# EAGLE design mother (EAGLE 9.6.2)
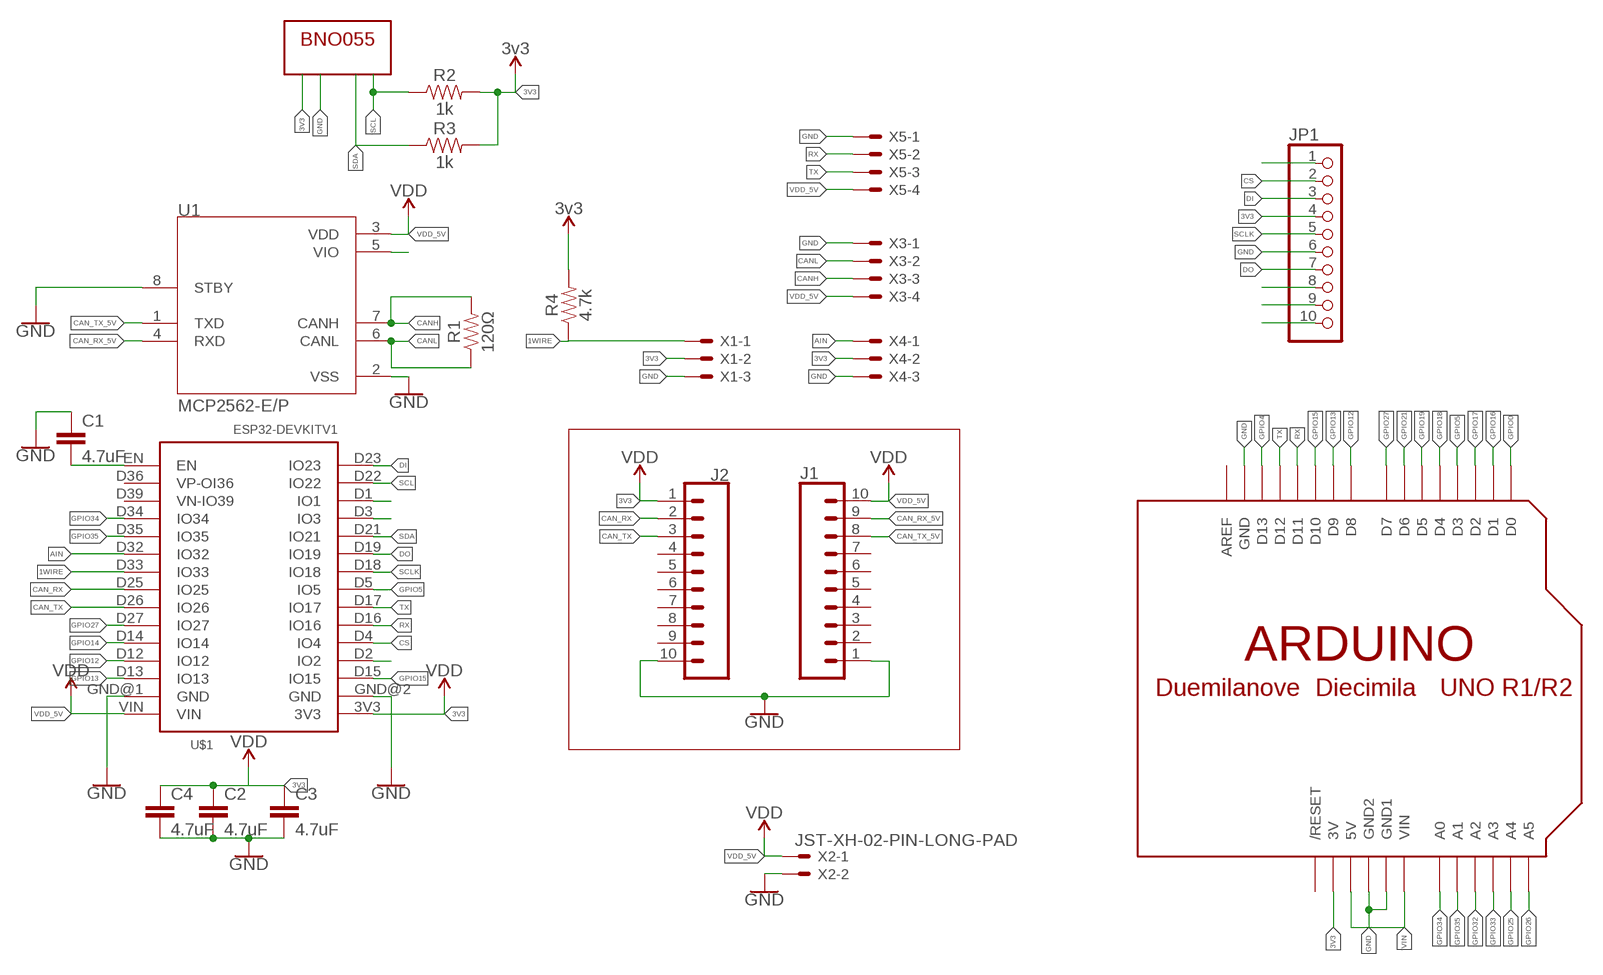
[diagram p0: schematic, sheet 1]

## Parts
C1  4.7uF  4.7UF-0603-6.3V-(10%)  [0603]
C2  4.7uF  4.7UF-0603-6.3V-(10%)  [0603]
C3  4.7uF  4.7UF-0603-6.3V-(10%)  [0603]
C4  4.7uF  4.7UF-0603-6.3V-(10%)  [0603]
J1  CONN_10"  [1X10]
J2  CONN_10"  [1X10]
JP1  PINHD-1X10  [1X10]
R1  120Ω  RESISTORAXIAL-0.3  [AXIAL-0.3]
R2  1k  1KOHM-0603-1/10W-1%  [0603]
R3  1k  1KOHM-0603-1/10W-1%  [0603]
R4  4.7k  4.7KOHM-0603-1/10W-1%  [0603]
U1  MCP2562-E/P  [DIP787W45P254L1016H533Q8]
U$1  ESP32DEVKITV1  [ESP32-DEVKITV1]
U$2  ARDUINO-NOHOLE  [ARDUINO-NOHOLE]
U$3  AE-BNO055-BO  [AE-BNO055-BO]
X1  JST-XH-03-PIN-LONG-PAD  [JST-XH-03-PACKAGE-LONG-PAD]
X2  JST-XH-02-PIN-LONG-PAD  [JST-XH-02-PACKAGE-LONG-PAD]
X3  JST-XH-04-PIN-LONG-PAD  [JST-XH-04-PACKAGE-LONG-PAD]
X4  JST-XH-03-PIN-LONG-PAD  [JST-XH-03-PACKAGE-LONG-PAD]
X5  JST-XH-04-PIN-LONG-PAD  [JST-XH-04-PACKAGE-LONG-PAD]

## Nets
1WIRE [lev3]: R4.1 U$1.D33(IO33) X1.1
3V3: C2.1 C3.1 C4.1 J2.1 JP1.4 R2.2 R3.2 R4.2 U$1.3V3 U$2.3V U$3.VIN X1.2 X4.2 ; supply symbol labelled VDD, 3v3
AIN: U$1.D32(IO32) X4.1
CAN_RX [lev3]: J2.2 U$1.D25(IO25)
CAN_RX_5V: J1.9 U1.4(RXD)
CAN_TX [lev3]: J2.3 U$1.D26(IO26)
CAN_TX_5V: J1.8 U1.1(TXD)
CANH [lev3]: R1.P$2 U1.7(CANH) X3.3
CANL [lev3]: R1.P$1 U1.6(CANL) X3.2
CS: JP1.2 U$1.D4(IO4)
DI: JP1.3 U$1.D23(IO23)
DO: JP1.7 U$1.D19(IO19)
EN: C1.2 U$1.EN
GND: C1.1 C2.2 C3.2 C4.2 J1.1 J2.10 JP1.6 U1.2(VSS) U1.8(STBY) U$1.GND@1(GND) U$1.GND@2(GND) U$2.GND U$2.GND1 U$2.GND2 U$3.GND X1.3 X2.2 X3.1 X4.3 X5.1
GPIO0: U$2.D0
GPIO1: U$1.D1(IO1)
GPIO4: U$2.D13
GPIO5: U$1.D5(IO5) U$2.D3
GPIO12: U$1.D12(IO12) U$2.D8
GPIO13: U$1.D13(IO13) U$2.D9
GPIO14: U$1.D14(IO14)
GPIO15: U$1.D15(IO15) U$2.D10
GPIO16: U$2.D1
GPIO17: U$2.D2
GPIO18: U$2.D4
GPIO19: U$2.D5
GPIO21: U$2.D6
GPIO25: U$2.A4
GPIO26: U$2.A5
GPIO27: U$1.D27(IO27) U$2.D7
GPIO32: U$2.A2
GPIO33: U$2.A3
GPIO34: U$1.D34(IO34) U$2.A0
GPIO35: U$1.D35(IO35) U$2.A1
N$1: JP1.1
N$2: U$1.D3(IO3)
N$5: U$1.D2(IO2)
N$7: U1.5(VIO)
N$8: JP1.8
N$9: JP1.9
N$10: JP1.10
RX: U$1.D16(IO16) U$2.D11 X5.2
SCL [lev3]: R2.1 U$1.D22(IO22) U$3.SCL
SCLK: JP1.5 U$1.D18(IO18)
SDA [lev3]: R3.1 U$1.D21(IO21) U$3.SDA
TX: U$1.D17(IO17) U$2.D12 X5.3
VDD_5V: J1.10 U1.3(VDD) U$1.VIN X2.1 X3.4 X5.4 ; supply symbol labelled VDD
VIN: U$2.5V U$2.VIN
Unconnected: J1.2 J1.3 J1.4 J1.5 J1.6 J1.7 J2.4 J2.5 J2.6 J2.7 J2.8 J2.9 U$1.D36(VP-OI36) U$1.D39(VN-IO39) U$2.AREF U$2.RESET(/RESET)

## Library data of the parts
C1-C4 = SparkFun-Capacitors:4.7UF: 4.7µF ceramic capacitors A capacitor is a passive two-terminal electrical component used to store electrical energy temporarily in an electric field.; PROD_ID: CAP-08280
J1 J2 = SparkFun-Connectors:CONN_10: Multi connection point. Often used as Generic Header-pin footprint for 0.1 inch spaced/style header connections On any of the 0.1 inch spaced packages, you can populate with these: Break Away Headers - Straight <https://www.sparkfun.com/products/116> (PRT-00116) Break Away Male Headers - Right Angle <https://www.sparkfun.com/products/553> (PRT-00553) Female Headers <https://www.sparkfun.com/products/115> (PRT-00115) Break Away Headers - Machine Pin <https://www.sparkfun.com/products/117> (PRT-00117) Break Away Female Headers - Swiss Machine Pin <https://www.sparkfun.com/products/743> (PRT-00743) Arduino Stackable Header - 10 Pin <https://www.sparkfun.com/products/11376> (PRT-11376) For SCREWTERMINALS and SPRING TERMINALS visit here: Screw Terimnals on SparkFun.com <https://www.sparkfun.com/search/results?term=Screw+Terminals> (5mm/3.5mm/2.54mm spacing) This device is also useful as a general connection point to wire up your design to another part of your project. Our various solder wires solder well into these plated through hole pads. Hook-Up Wire - Assortment (Stranded, 22 AWG) <https://www.sparkfun.com/products/11375> (PRT-11375) Hook-Up Wire - Assortment (Solid Core, 22 AWG) <https://www.sparkfun.com/products/11367> (PRT-11367) View the entire wire category on our website here <https://www.sparkfun.com/categories/141> Special notes: Molex polarized connector foot print use with SKU : PRT-08231 with associated crimp pins and housings. 1MM SMD Version SKU: PRT-10208 NOTES ON THE VARIANTS LOCK and LOCK_LONGPADS... This footprint was designed to help hold the alignment of a through-hole component (i.e. 6-pin header) while soldering it into place. You may notice that each hole has been shifted either up or down by 0.005 of an inch from it's more standard position (which is a perfectly straight line). This slight alteration caused the pins (the squares in the middle) to touch the edges of the holes. Because they are alternating, it causes a "brace" to hold the component in place. 0.005 has proven to be the perfect amount of "off-center" position when using our standard breakaway headers. Although looks a little odd when you look at the bare footprint, once you have a header in there, the alteration is very hard to notice. Also,if you push a header all the way into place, it is covered up entirely on the bottom side.; PROD_ID: CONN-11563
JP1 = pinhead:PINHD-1X10: PIN HEADER
R1 = SparkFun-Resistors:RESISTOR: Generic Resistor Package
R2 R3 = SparkFun-Resistors:1KOHM: 1kΩ resistor A resistor is a passive two-terminal electrical component that implements electrical resistance as a circuit element. Resistors act to reduce current flow, and, at the same time, act to lower voltage levels within circuits. - Wikipedia; PROD_ID: RES-07856
R4 = SparkFun-Resistors:4.7KOHM: 4.7kΩ resistor A resistor is a passive two-terminal electrical component that implements electrical resistance as a circuit element. Resistors act to reduce current flow, and, at the same time, act to lower voltage levels within circuits. - Wikipedia; PROD_ID: RES-07857
U1 = MCP2562-E_P:MCP2562-E/P: Integrated circuit: transceiver CAN; Channels: 1; 1Mbps; DIP8 Check availability <https://pricing.snapeda.com/parts/MCP2562-E/P/Microchip/view-part?ref=eda>; AVAILABILITY: In Stock; DESCRIPTION: 1/1 Transceiver Half CANbus 8-PDIP; MF: Microchip; MP: MCP2562-E/P; PACKAGE: DIP-8 Microchip; PRICE: None; PURCHASE-URL: https://pricing.snapeda.com/search/part/MCP2562-E/P/?ref=eda
U$1 = ESP32-DEVKITV1:ESP32DEVKITV1
U$2 = adafruit:ARDUINO: Arduino Diecimila/Duemilanove Make a shield with ease, this package has all the named pins as well as the two mounting drill holes and an outline of the USB and DC power connector. The outline is on the DIMENSION layer, so if your board house uses it they will cut the outline to match. http://www.ladyada.net/library/pcb/eaglelibrary.html
U$3 = AE-BNO055:AE-BNO055-BO
X1 X4 = JST XH Connectors:JST-XH-03-PIN: JST XH Connector 2 Pin Wire to board connector. Pitch: 2,54 mm, (0.100") Number of pins: 3 Created by Rembrandt Electronics www.rembrandtelectronics.com
X2 = JST XH Connectors:JST-XH-02-PIN: JST XH Connector 2 Pin Wire to board connector. Pitch: 2,54 mm, (0.100") Number of pins: 2 Created by Rembrandt Electronics www.rembrandtelectronics.com
X3 X5 = JST XH Connectors:JST-XH-04-PIN: JST XH Connector 2 Pin Wire to board connector. Pitch: 2,54 mm, (0.100") Number of pins: 4 Created by Rembrandt Electronics www.rembrandtelectronics.com

## Net classes
1 lev3: clearance 0.5 mm

## Board
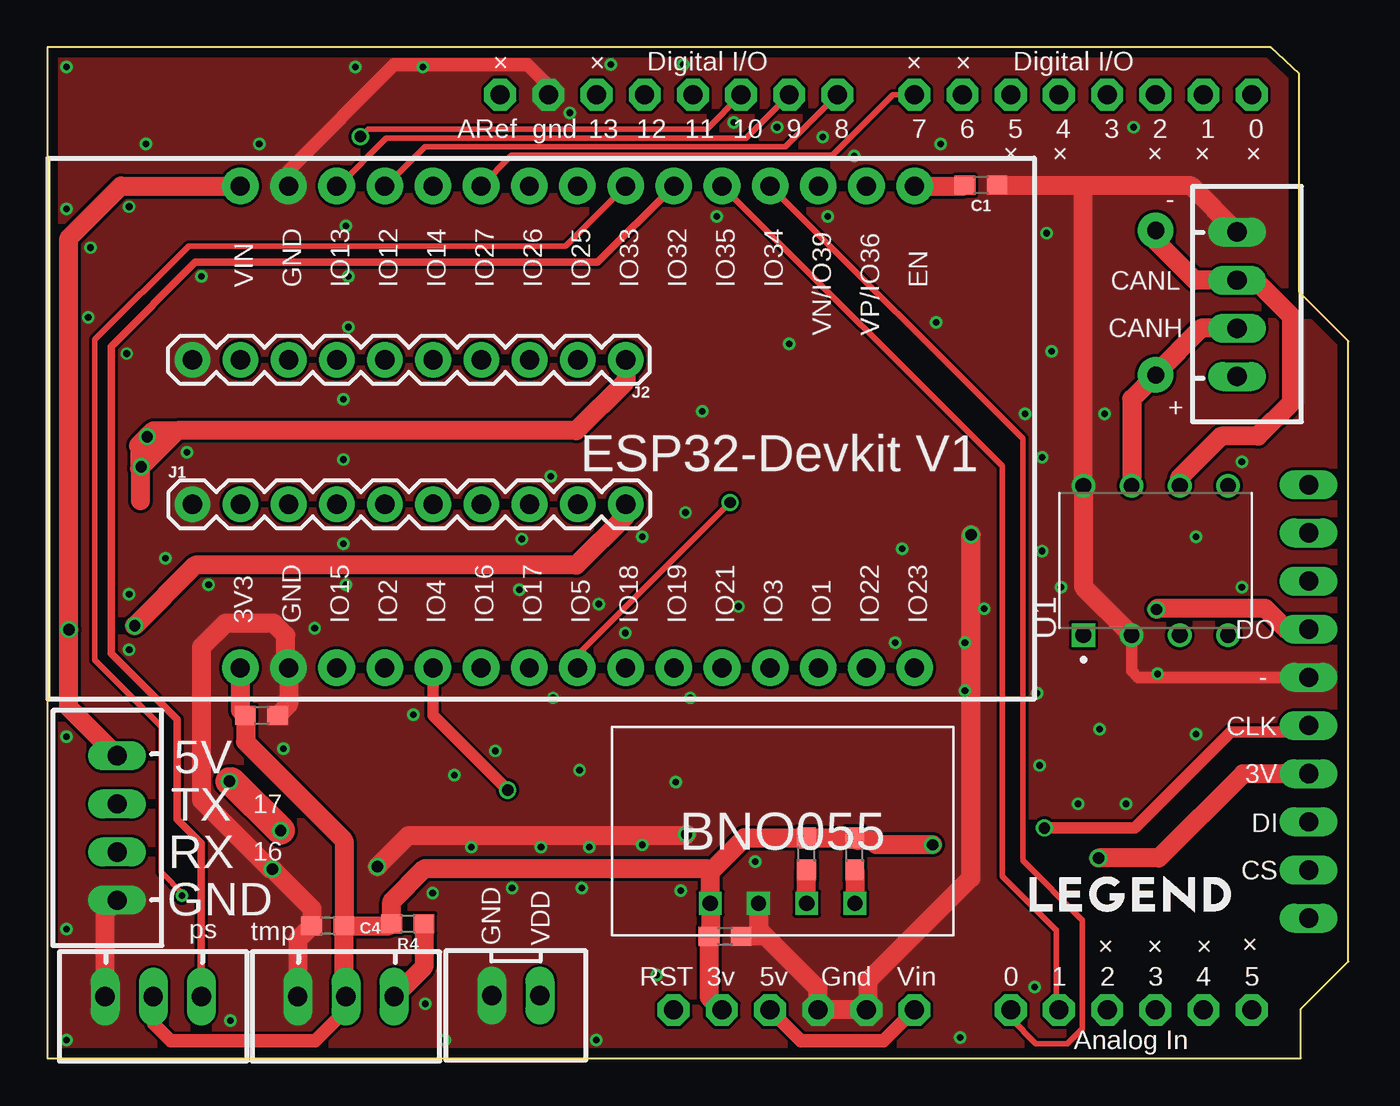
[diagram p1: board, top side]
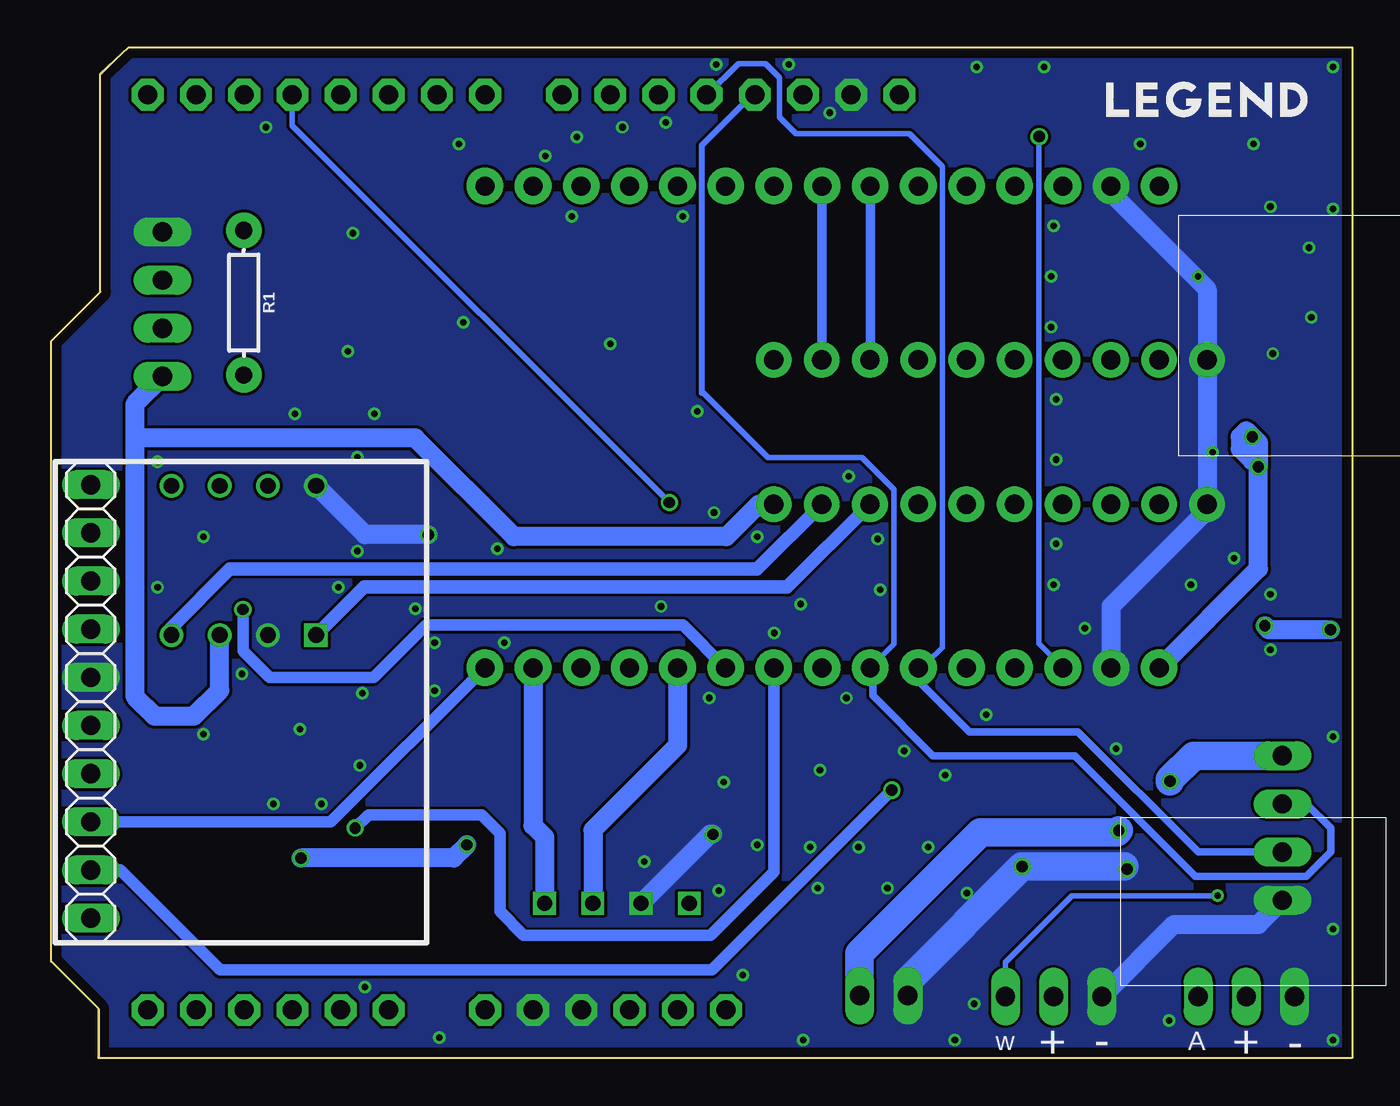
[diagram p2: board, bottom side, seen from below]

Size 68.6 x 53.3 mm. Coordinates in mm from the lower left corner, seen from the top.
Outline: 0,53.3 0,0 66.1,0 66.1,2.6 68.6,5.1 68.6,37.8 66,40.4 66,51.9 64.5,53.3 0,53.3
Copper layers (1*16): Top 0.035mm / dielectric 1.6mm / Bottom 0.035mm
Design rules "Elecrow_2-layer_PCB_eagle_rule": minimum track width 6mil, minimum drill 12mil, track to track 6mil, track to pad 6mil, pad to pad 6mil, via to via 8mil, smd to smd 0mil, copper to edge 20mil, drill to drill 10mil, minimum pad ring 6mil, minimum via ring 6mil, stop-mask expansion 0mil, vias tented up to drill 100mil, thermal gap 10mil

### Footprints (pad centres in the part's own frame; a part is rotated, then mirrored left to right if it is on the bottom)
0603 = smd 1.1 x 1: 1 -0.85,0; 2 0.85,0
1X10 = drill 1.016 pad 1.88: 1 0,0; 2 2.54,0; 3 5.08,0; 4 7.62,0; 5 10.16,0; 6 12.7,0; 7 15.24,0; 8 17.78,0; 9 20.32,0; 10 22.86,0
1X10' = drill 1.016 long: 1 -11.43,0; 2 -8.89,0; 3 -6.35,0; 4 -3.81,0; 5 -1.27,0; 6 1.27,0; 7 3.81,0; 8 6.35,0; 9 8.89,0; 10 11.43,0
AXIAL-0.3 = drill 0.9 pad 1.88: P$1 -3.81,0; P$2 3.81,0
DIP787W45P254L1016H533Q8 = drill 0.83 square: 1 -3.937,3.81 | drill 0.83: 2 -3.937,1.27; 3 -3.937,-1.27; 4 -3.937,-3.81; 5 3.937,-3.81; 6 3.937,-1.27; 7 3.937,1.27; 8 3.937,3.81
ESP32-DEVKITV1 = drill 1 pad 1.93: 3V3 -16.52,-12.27; D1 13.96,-12.27; D2 -8.9,-12.27; D3 11.42,-12.27; D4 -6.36,-12.27; D5 1.26,-12.27; D12 -8.9,13.135; D13 -11.44,13.135; D14 -6.36,13.135; D15 -11.44,-12.27; D16 -3.82,-12.27; D17 -1.28,-12.27; D18 3.8,-12.27; D19 6.34,-12.27; D21 8.88,-12.27; D22 16.5,-12.27; D23 19.04,-12.27; D25 1.26,13.135; D26 -1.28,13.135; D27 -3.82,13.135; D32 6.34,13.135; D33 3.8,13.135; D34 11.42,13.135; D35 8.88,13.135; D36 16.5,13.135; D39 13.96,13.135; EN 19.04,13.135; GND@1 -13.98,13.135; GND@2 -13.98,-12.27; VIN -16.52,13.135
ARDUINO-NOHOLE = drill 1 pad 1.676 octagon: 3V 35.56,2.54; 5V 38.1,2.54; A0 50.8,2.54; A1 53.34,2.54; A2 55.88,2.54; A3 58.42,2.54; A4 60.96,2.54; A5 63.5,2.54; AREF 23.876,50.8; D0 63.5,50.8; D1 60.96,50.8; D2 58.42,50.8; D3 55.88,50.8; D4 53.34,50.8; D5 50.8,50.8; D6 48.26,50.8; D7 45.72,50.8; D8 41.656,50.8; D9 39.116,50.8; D10 36.576,50.8; D11 34.036,50.8; D12 31.496,50.8; D13 28.956,50.8; GND 26.416,50.8; GND1 43.18,2.54; GND2 40.64,2.54; RESET 33.02,2.54; VIN 45.72,2.54
AE-BNO055-BO = drill 0.8 square: GND -1.27,-3.81; SCL 3.81,-3.81; SDA 1.27,-3.81; VIN -3.81,-3.81
JST-XH-03-PACKAGE-LONG-PAD = drill 1.016 long: 1 -2.54,0; 2 0,0; 3 2.54,0
JST-XH-02-PACKAGE-LONG-PAD = drill 1.016 long: 1 -1.27,0; 2 1.27,0
JST-XH-04-PACKAGE-LONG-PAD = drill 1.016 long: 1 -3.81,0; 2 -1.27,0; 3 1.27,0; 4 3.81,0

### Placement (x,y rotation side)
C1  49.23,46.03 180 top
C2  11.29,18.07 0 top
C3  35.74,6.43 0 top
C4  14.78,6.98 180 top
J1  7.64,29.2 0 top
J2  30.5,36.83 180 top
JP1  [1X10']  66.51,18.81 90 bottom
R1  58.44,39.84 270 bottom
R2  42.57,10.77 90 top
R3  40.03,10.77 90 top
R4  19,7.09 180 top
U1  58.44,26.25 90 top
U$1  26.69,32.86 0 top
U$2  0,0 0 top
U$3  38.77,11.97 0 top
X1  15.74,3.24 180 top
X2  24.7,3.3 180 top
X3  62.73,39.76 270 top
X4  5.58,3.24 180 top
X5  3.67,12.13 90 top

### Tracks (layer width: path | path; a pad name or v marks a point on that pad's centre or on a via)
1WIRE  (via drill 0.35)
  Top 0.3: U$1.D33 27.33,42.83 7.45,42.83 2.51,37.89 2.51,20.99 6,17.5 6,9.81 7.17,8.64 v7.09,8.57
  Top 1: R4.1 19.85,4.82 X1.1
  Bottom 0.3: X1.1 18.28,5.05 14.76,8.57 v7.09,8.57
3V3  (via drill 0.6)
  Top 0.7: X4.2 5.6,3.22 5.6,1.8 6.49,0.91 14.11,0.91 15.74,2.54 X1.2
  Top 1: U$2.3V 34.89,3.21 C3.1 34.95,6.5 U$3.VIN 34.95,9.82 | X1.2 15.63,3.35 C4.1 | C4.1 18.04,6.98 R4.2 18.15,8.25 19.9,10 34.78,10 34.95,9.82 | 34.95,9.82 36.75,11.62 R3.2 R2.2 42.72,11.47 43.48,11.47 43.71,11.25 v46.67,11.25 | U$1.3V3 10.17,18.35 C2.1 10.44,16.68 15.63,11.48 C4.1 | J2.1 30.5,35.72 27.88,33.09 6.85,33.09 | v5.26,32.77 5.58,33.09 6.85,33.09 | 6.85,33.09 v4.95,31.18 | v4.95,31.18 4.86,31.1 4.86,32.37 v5.26,32.77 | v4.95,31.18 4.9,31.14 4.9,29.4 | JP1.4 63.05,15 58.6,10.55 v55.43,10.55 | v5.26,32.77 v5.26,32.76 4.8,32.3
  Bottom 1: U$1.3V3 4.95,25.81 v4.95,31.18 | 5.26,32.1 5.26,31.5 5.9,32.14 5.9,32.77 5.58,33.09 v5.26,32.77 | 5.26,32.1 v5.26,32.77 | 5.26,32.1 4.95,31.79 v4.95,31.18 | v5.26,32.77 4.95,32.45 v4.95,31.18 | v46.67,11.25 47.37,10.55 v55.43,10.55
AIN
  Top 0.4: U$1.D32 29.02,41.98 7.8,41.98 3.36,37.53 3.36,21.34 6.85,17.85 6.85,12.59 8.12,11.32 X4.1
CAN_RX
  Bottom 0.5: U$1.D25 27.95,36.84 J2.2
CAN_RX_5V
  Bottom 0.7: J1.9 31.38,25.79 59.17,25.79 62.25,22.71 U1.4
CAN_TX
  Bottom 0.5: U$1.D26 25.41,36.84 J2.3
CAN_TX_5V
  Bottom 0.7: J1.8 29.79,24.84 52.11,24.84 U1.1
CANH
  Top 1: X3.3 60.83,38.49 58.44,36.1 R1.P$2 57.17,34.76 U1.7
CANL
  Top 1: R1.P$1 58.44,43.09 60.51,41.03 X3.2 63.7,41.03 65.59,39.14 65.59,34.55 63.84,32.8 61.9,32.8 59.71,30.61 U1.6
CS  (via drill 0.6)
  Top 0.6: v24.27,14.13 20.33,18.08 U$1.D4
  Bottom 0.6: JP1.2 64.96,9.92 59.69,4.65 33.76,4.65 v24.27,14.13
DI
  Bottom 0.6: JP1.3 53.86,12.46 U$1.D23
DO  (via drill 0.6)
  Top 1: JP1.7 65.31,22.62 64.21,23.72 58.55,23.72 v58.48,23.66
  Bottom 0.6: v58.48,23.66 58.48,21.47 57.08,20.06 51.6,20.06 48.84,22.83 35.27,22.83 U$1.D19
EN
  Top 1: U$1.EN 48.34,45.99 C1.2
GND  (via drill 0.35, 0.6)
  Top 0.6: U1.2 57.17,20.41 57.5,20.08 JP1.6
  Top 0.7: U$2.GND 26.42,51.28 25.31,52.39 18.29,52.39 12.71,46.81 U$1.GND@1
  Top 1: 37.86,6.43 40.64,3.65 U$2.GND2 U$2.GND1 43.3,2.66 43.3,4.1 48.7,9.5 v48.7,27.6 | 37.86,6.43 C3.2 | X1.3 13.2,6.25 C4.2 13.93,7.9 v11.87,9.96 11.77,9.96 8.12,13.61 8.12,21.66 9.39,22.93 11.93,22.93 12.56,22.3 12.56,20.73 U$1.GND@2 12.71,18.64 C2.2 | U$3.GND 37.49,6.79 37.86,6.43 | X4.3 3.04,7.69 X5.1 | C1.1 54.6,46.03 | 54.6,46.03 60.27,46.03 X3.1 | 54.6,46.03 54.63,46 U1.8 54.63,24.85 U1.2 | v33.7,11.8 33.63,11.73 19.03,11.73 v17.4,10.1
  Bottom 1: X5.1 4.95,7.05 9.39,7.05 X1.3 | U$1.GND@2 12.71,23.82 7.64,28.89 J1.1 J2.10 7.64,40.55 12.56,45.47 12.56,45.85 U$1.GND@1 | v48.7,27.6 52.04,27.6 U1.8 | U$3.GND 33.85,11.8 v33.7,11.8 | 12,10.1 v11.87,9.96
  Bottom 1.5: X2.2 23.43,4.07 v17.4,10.1 12,10.1
  other vias: 1.01,52.27 1.01,44.77 4.31,44.9 2.28,42.74 2.15,39.06 8.12,41.22 15.74,43.88 15.61,34.74 15.61,31.57 15.61,27.12 25.01,27.38 24.88,24.71 12.44,16.33 19.3,18.1 23.61,16.2 20.31,8.71 19.93,2.86 1.01,0.96 9.64,1.97 1.01,16.96 4.31,21.53 4.31,24.45 6.21,26.36 8.5,24.96 14.09,22.68 21.45,14.93 26.03,11.12 22.34,11.12 24.5,8.96 28.19,8.96 28.95,0.96 32.12,4.39 31.36,11.25 33.39,8.83 37.33,10.36 48.12,1.09 54.35,13.4 56.89,13.4 60.57,17.09 52.19,19.25 48.38,19.37 33.9,18.99 26.66,18.99 28.06,15.18 33.14,14.55 28.57,11.12 33.65,28.77 26.54,30.68 34.54,34.11 35.3,44.39 41.14,44.39 52.06,3.75 55.49,17.34 36.44,23.82 30.47,22.42 29.07,23.95 49.4,23.69 45.08,26.87 31.36,27.5 39.11,37.66 40.89,48.58 38.47,49.09 36.19,49.35 27.55,49.85 19.8,52.27 16.25,52.27 15.87,41.22 15.87,38.55 4.18,37.15 42.54,47.57 57.27,49.09 52.7,43.5 46.85,38.8 52.95,37.28 51.55,33.98 55.74,33.98 52.44,31.69 53.46,24.84 52.44,26.74 62.98,24.84 62.98,31.44 15.74,24.96 7.36,31.95 5.2,48.2 11.17,48.2 33.52,52.39 29.71,52.39 60.57,27.5 48.38,21.91 44.7,21.91 52.32,15.44 1.01,6.8 20.95,0.96 47.11,48.2 58.54,20.26
  pour Top (no thermals): -1.5,55.5 -1.5,-2.5 73.5,-2.5 73.5,55.5
  pour Bottom (no thermals): -3.5,57.5 -3.5,-1.5 72.5,-1.5 72.5,57.5
GPIO5  (via drill 0.6)
  Top 0.3: v36,29.3 27.95,21.25 U$1.D5
  Bottom 0.3: U$2.D3 55.88,49.18 v36,29.3
GPIO12
  Top 0.3: U$2.D8 38.91,48.06 19.91,48.06 17.84,45.99 U$1.D12
GPIO13
  Top 0.3: U$1.D13 15.35,45.99 17.87,48.51 36.83,48.51 U$2.D9
GPIO15  (via drill 0.6)
  Top 0.3: U$2.D10 34.78,49 16.9,49 v16.5,48.6
  Bottom 0.3: v16.5,48.6 16.52,48.6 16.52,21.86 U$1.D15
GPIO27
  Top 0.3: U$2.D7 44.59,50.8 41.4,47.61 24.48,47.61 U$1.D27
GPIO34
  Top 0.3: U$1.D34 51.44,32.67 51.44,10.42 54.58,7.27 54.58,1.55 53.8,0.76 52.13,0.76 50.8,2.1 U$2.A0
GPIO35
  Top 0.3: U$1.D35 50.35,31.21 50.35,9.6 53.2,6.74 53.2,2.68 U$2.A1
RX
  Bottom 0.152: 22.43,20.84 22.48,20.79 22.87,20.4
  Bottom 0.3: U$2.D11 34.01,50.8 32.37,52.44 30.92,52.44 30.2,51.71 30.2,49.63 29.33,48.76 23.35,48.76 21.6,47.01 21.6,21.67 22.43,20.84 | U$1.D16 22.68,20.59 22.48,20.79
  Bottom 0.4: X5.2 8.12,10.87 14.47,17.21 20.18,17.21 22.87,19.9 22.87,20.4 U$1.D16
SCL
  Top 1: R2.1 U$3.SCL
  Bottom 1: U$1.D22 43.19,12.27 42.58,11.66 U$3.SCL
SCLK  (via drill 0.6)
  Top 0.6: JP1.5 66.19,17.21 62.41,17.21 57.33,12.13 v52.57,12.13
  Bottom 0.6: v52.57,12.13 51.87,12.84 45.9,12.84 44.93,11.87 44.93,7.74 43.68,6.49 33.84,6.49 30.49,9.83 U$1.D18
SDA
  Top 1: U$3.SDA R3.1
  Bottom 1: U$1.D21 35.57,16.5 40.03,12.04 U$3.SDA
TX
  Bottom 0.152: U$2.D12 34.22,48.07 34.22,35.08 30.82,31.67 30.8,31.67
  Bottom 0.3: U$1.D17 24.15,21.84 24.15,29.99 25.84,31.67 30.8,31.67 34.2,35.08 34.22,35.08 34.3,35.08 34.3,48.12 31.61,50.8 U$2.D12
  Bottom 0.4: X5.3 2.41,13.4 1.14,12.13 1.14,10.87 2.41,9.6 8.25,9.6 14.61,15.95 22.09,15.95 25.27,19.12 25.27,20.44 U$1.D17
VDD_5V  (via drill 0.6)
  Top 1: X5.4 1.14,18.48 v1.14,22.6 1.14,43.25 3.88,45.99 U$1.VIN | J1.10 30.5,28.6 27.9,26 7.8,26 v4.6,22.8
  Top 1.5: v12.3,12 9.7,14.6 v9.6,14.6
  Bottom 1: X3.4 64.19,34.49 64.19,32.7 | U1.3 59.71,19.39 61.07,18.03 63.15,18.03 64.19,19.07 64.19,32.7 | v4.6,22.8 4.4,22.6 v1.14,22.6 | J1.10 31.3,29.2 33,27.5 44.2,27.5 49.4,32.7 64.19,32.7
  Bottom 1.5: X2.1 25.97,5.53 19.6,11.9 12.4,11.9 v12.3,12 | v9.6,14.6 9.6,14.7 8.36,15.95 X5.4
VIN
  Top 0.7: U$2.5V 39.73,0.91 44.09,0.91 U$2.VIN

### Text on the board
tNames: × | × | × | × | × | × | × | × | × | - | CANL | CANH | + | DO | - | CLK | 5V | 3V | TX | 17 | DI | RX | 16 | CS | GND | GND | VDD | ps | tmp | × | × | × | ×
bNames: - | - | + | A | + | w
tValues: 17 | 16